# EAGLE design volume-control-rev-a (EAGLE 7.3.0)
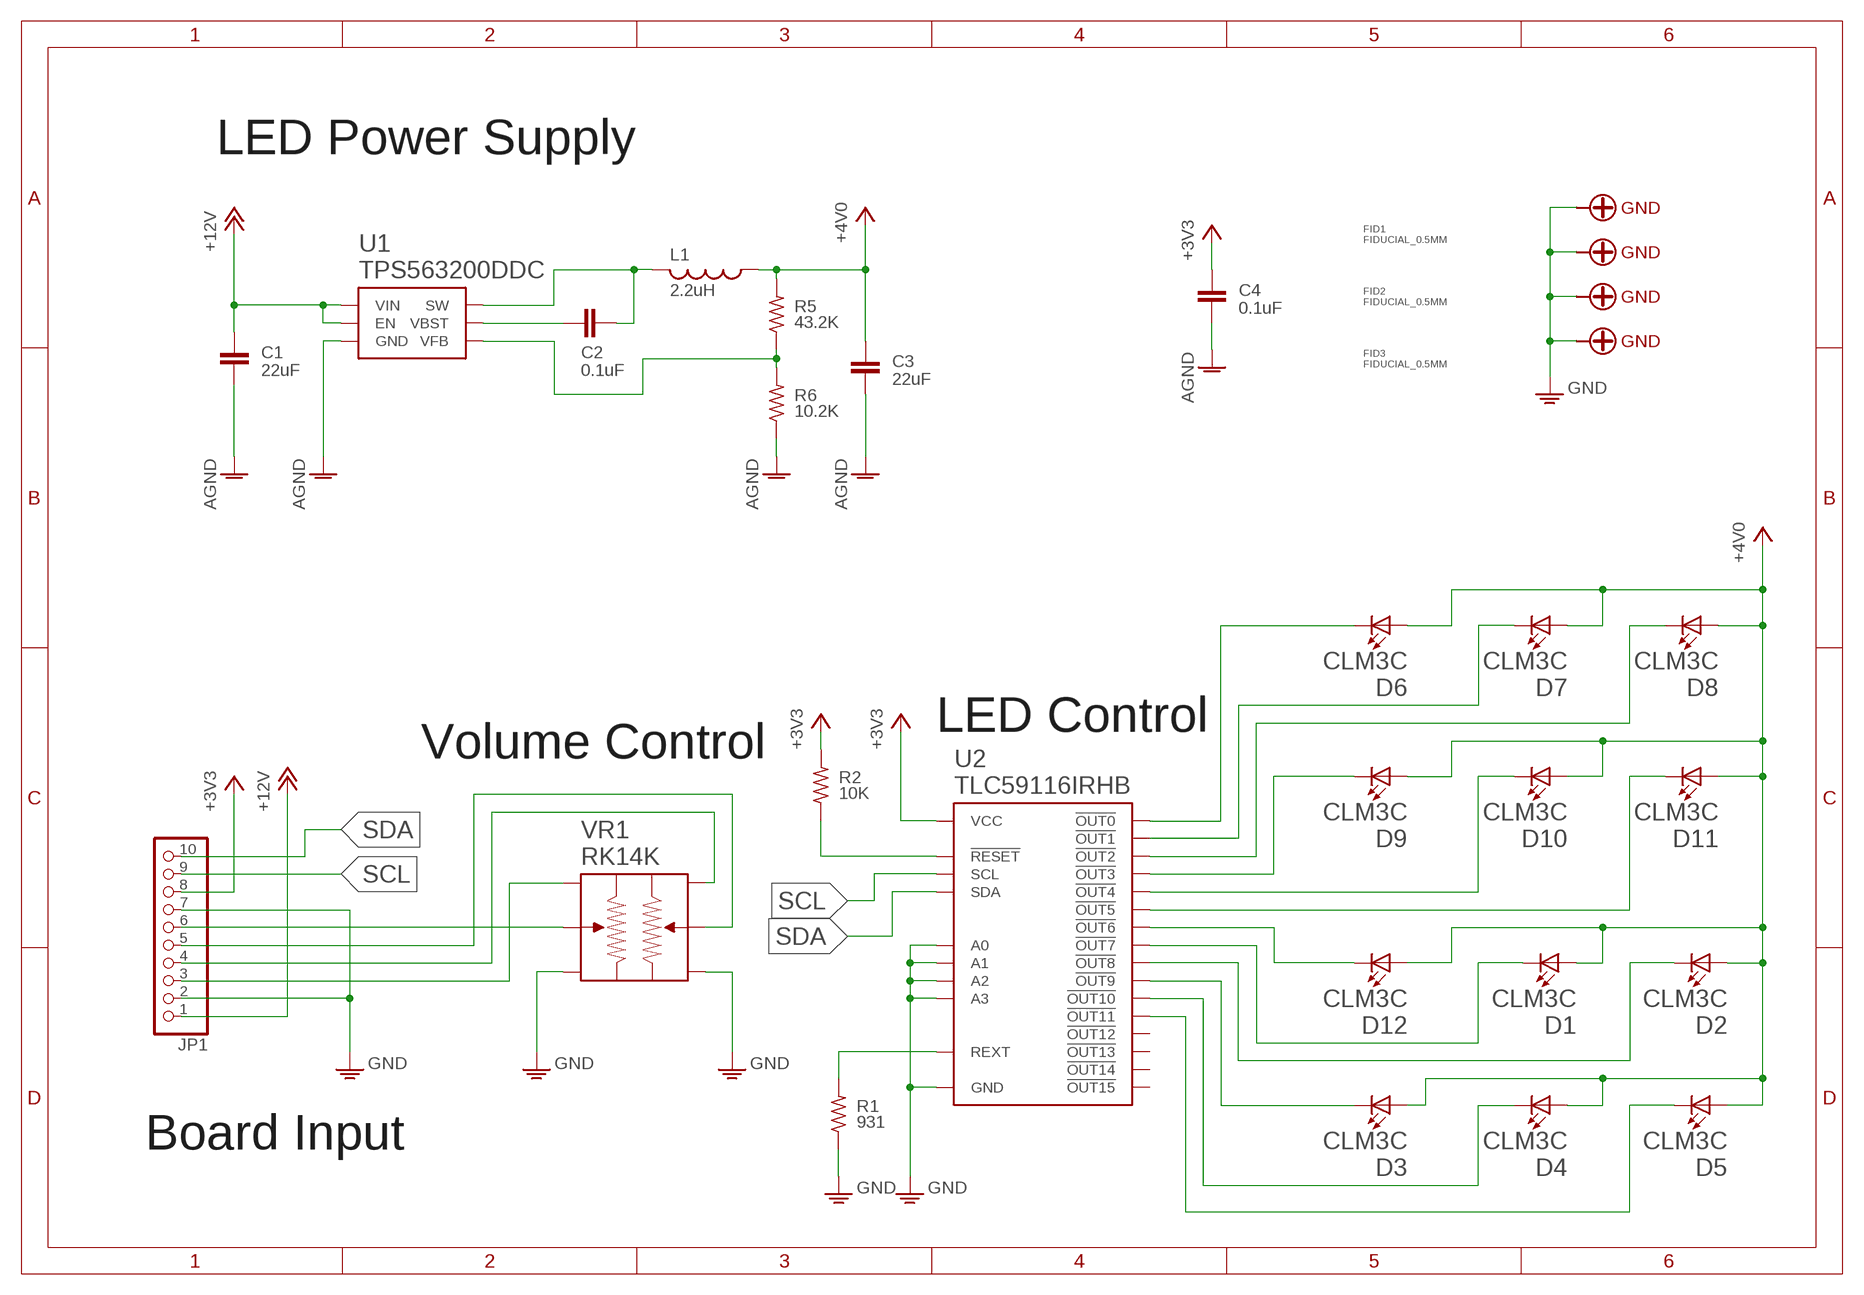
[diagram p0: schematic, sheet 1]

## Parts
AGND  SCREW-THRU-GND-#4  [SCREW-THRU-GND-#4]
C1  22uF  CAPACITOR-1210  [C1210]
C2  0.1uF  CAPACITOR-HORIZONTAL-0603  [C0603]
C3  22uF  CAPACITOR-1210  [C1210]
C4  0.1uF  CAPACITOR-0402  [C0402]
D1  CLM3C  [PLCC-2]
D2  CLM3C  [PLCC-2]
D3  CLM3C  [PLCC-2]
D4  CLM3C  [PLCC-2]
D5  CLM3C  [PLCC-2]
D6  CLM3C  [PLCC-2]
D7  CLM3C  [PLCC-2]
D8  CLM3C  [PLCC-2]
D9  CLM3C  [PLCC-2]
D10  CLM3C  [PLCC-2]
D11  CLM3C  [PLCC-2]
D12  CLM3C  [PLCC-2]
FID1  FIDUCIAL_0.5MM  [FIDUCIAL_0.5MM]
FID2  FIDUCIAL_0.5MM  [FIDUCIAL_0.5MM]
FID3  FIDUCIAL_0.5MM  [FIDUCIAL_0.5MM]
JP1  PINHD-1X10  [1X10]
L1  2.2uH  INDUCTOR-HORIZONTALXFL4020  [COILCRAFT-XFL4020]
R1  931  RESISTOR-0402  [R0402]
R2  10K  RESISTOR-0402  [R0402]
R5  43.2K  RESISTOR-0402  [R0402]
R6  10.2K  RESISTOR-0402  [R0402]
U1  TPS563200DDC  TPS562200DDC  [R-PDSO-G6-DBV]
U2  TLC59116IRHB  [S-PVQFN-N32-RHB]
U$2  SCREW-THRU-GND-#4  [SCREW-THRU-GND-#4]
U$3  SCREW-THRU-GND-#4  [SCREW-THRU-GND-#4]
U$4  SCREW-THRU-GND-#4  [SCREW-THRU-GND-#4]
VR1  RK14K  [RK14K]

## Nets
+3V3: C4.1 JP1.8 R2.2 U2.P$27(VCC)
+4V0: C3.1 D1.ANODE(A) D2.ANODE(A) D3.ANODE(A) D4.ANODE(A) D5.ANODE(A) D6.ANODE(A) D7.ANODE(A) D8.ANODE(A) D9.ANODE(A) D10.ANODE(A) D11.ANODE(A) D12.ANODE(A) L1.P$1 R5.2
+12V: C1.1 JP1.1 U1.3(VIN) U1.5(EN)
AGND: C1.2 C3.2 C4.2 R6.1 U1.1(GND)
GND: AGND.P$1(GND) AGND.P$2(GND) AGND.P$3(GND) AGND.P$4(GND) AGND.P$5(GND) AGND.P$6(GND) AGND.P$7(GND) AGND.P$8(GND) AGND.P$9(GND) JP1.2 JP1.7 R1.1 U2.P$1(A2) U2.P$2(A3) U2.P$7(GND) U2.P$18(GND) U2.P$23(GND) U2.P$31(A0) U2.P$32(A1) U2.P$EP1(GND) U2.P$EP2(GND) U2.P$EP3(GND) U2.P$EP4(GND) U2.P$EP5(GND) U2.P$EP(GND) U$2.P$1(GND) U$2.P$2(GND) U$2.P$3(GND) U$2.P$4(GND) U$2.P$5(GND) U$2.P$6(GND) U$2.P$7(GND) U$2.P$8(GND) U$2.P$9(GND) U$3.P$1(GND) U$3.P$2(GND) U$3.P$3(GND) U$3.P$4(GND) U$3.P$5(GND) U$3.P$6(GND) U$3.P$7(GND) U$3.P$8(GND) U$3.P$9(GND) U$4.P$1(GND) U$4.P$2(GND) U$4.P$3(GND) U$4.P$4(GND) U$4.P$5(GND) U$4.P$6(GND) U$4.P$7(GND) U$4.P$8(GND) U$4.P$9(GND) VR1.L3(OUT_L) VR1.R3(OUT_R)
LEFT_IN [audio]: JP1.3 VR1.L1(IN_L)
LEFT_OUT [audio]: JP1.6 VR1.L2(WIPER_L)
N$5: D6.CATHODE(C) U2.P$3(!OUT0)
N$6: D7.CATHODE(C) U2.P$4(!OUT1)
N$7: D8.CATHODE(C) U2.P$5(!OUT2)
N$8: D3.CATHODE(C) U2.P$15(!OUT9)
N$9: D4.CATHODE(C) U2.P$16(!OUT10)
N$10: D5.CATHODE(C) U2.P$17(!OUT11)
N$11: D9.CATHODE(C) U2.P$6(!OUT3)
N$12: D10.CATHODE(C) U2.P$8(!OUT4)
N$13: D11.CATHODE(C) U2.P$9(!OUT5)
N$14: D12.CATHODE(C) U2.P$10(!OUT6)
N$15: D1.CATHODE(C) U2.P$11(!OUT7)
N$16: D2.CATHODE(C) U2.P$14(!OUT8)
N$17: C2.2 L1.P$2 U1.2(SW)
N$18: C2.1 U1.6(VBST)
N$19: R5.1 R6.2 U1.4(VFB)
N$20: R2.1 U2.P$24(!RESET)
N$23: R1.2 U2.P$30(REXT)
RIGHT_IN [audio]: JP1.4 VR1.R1(IN_R)
RIGHT_OUT [audio]: JP1.5 VR1.R2(WIPER_R)
SCL: JP1.9 U2.P$25(SCL)
SDA: JP1.10 U2.P$26(SDA)
Unconnected: U2.P$19(!OUT12) U2.P$20(!OUT13) U2.P$21(!OUT14) U2.P$22(!OUT15)

## Notes on the sheet
- LED Power Supply
- LED Control
- Volume Control
- Board Input

## Library data of the parts
AGND U$2-U$4 = screws:SCREW-THRU-GND
C1 C3 C4 = passives:CAPACITOR: Capacitor
C2 = passives:CAPACITOR-HORIZONTAL: Capacitor, horizontal
D1-D12 = cree:CLM3C: Cree® PLCC2 1-in-1 SMD LED CLM3C; MPN: CLM3C-WKW-CXAYA453
FID1-FID3 = MF_Aesthetics:FIDUCIAL: Library: MF_Aesthetics Description: Fiducial marking for PCB alignment inside PNP and other machines.; HOUSEPART: NO; POPULATE: 0
JP1 = pin-headers:PINHD-1X10: PIN HEADER; MPN: 22-05-3101
L1 = passives:INDUCTOR-HORIZONTAL: INDUCTOR, American symbol; MPN: XFL4020-222MEB
R1 R2 R5 R6 = passives:RESISTOR
U1 = texas-instruments:TPS562200: 4.5-V To 17-V Input, 2-A, Synchronous Step-Down Voltage Regulator; MPN: TPS563200DDCT
U2 = texas-instruments:TLC59116: 16-Channel FM+ I2C-Bus Constant-Current LED Sink Driver; MPN: TLC59116IRHB
VR1 = alps:RK14K: 14mm Size Insulated Shaft Snap-in Type RK14K Series

## Net classes
1 audio: clearance 0.305 mm

## Board
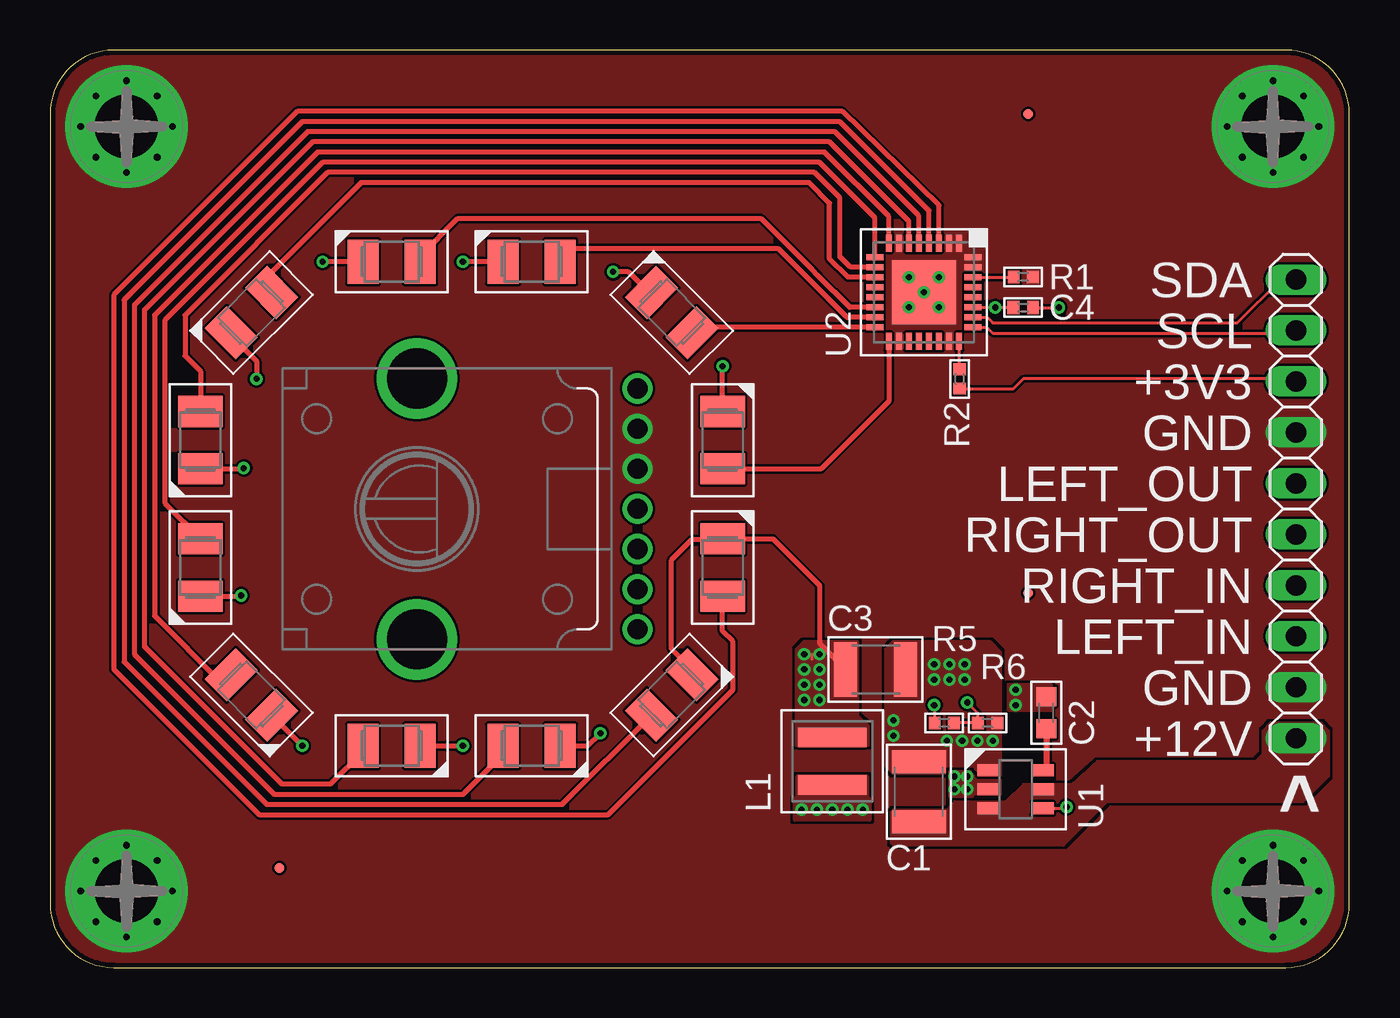
[diagram p1: board, top side]
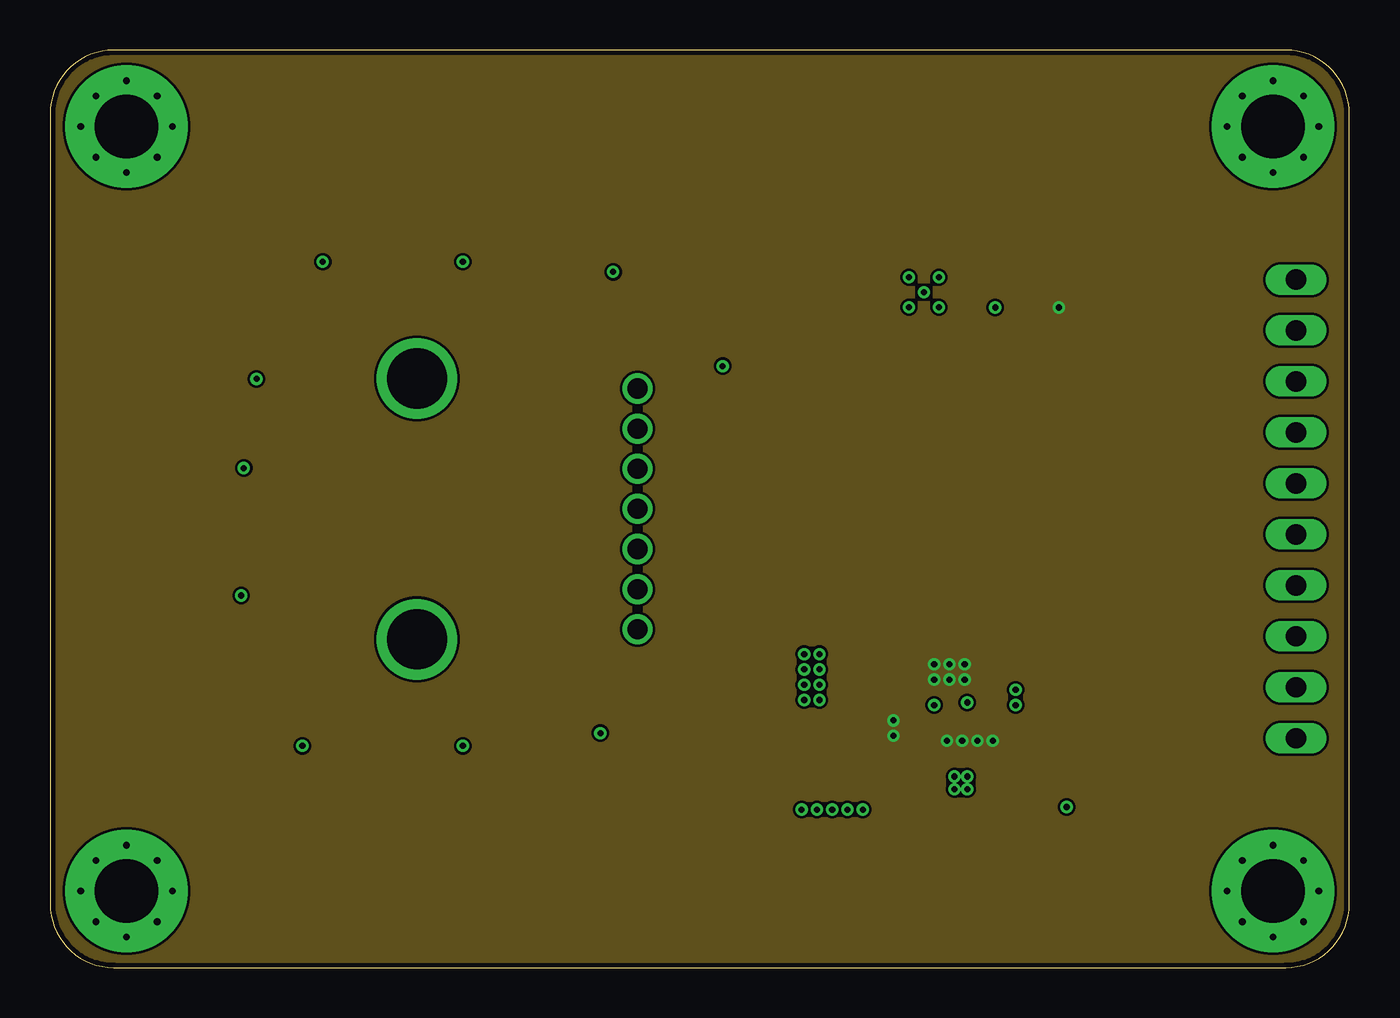
[diagram p2: board, inner layer Route2]
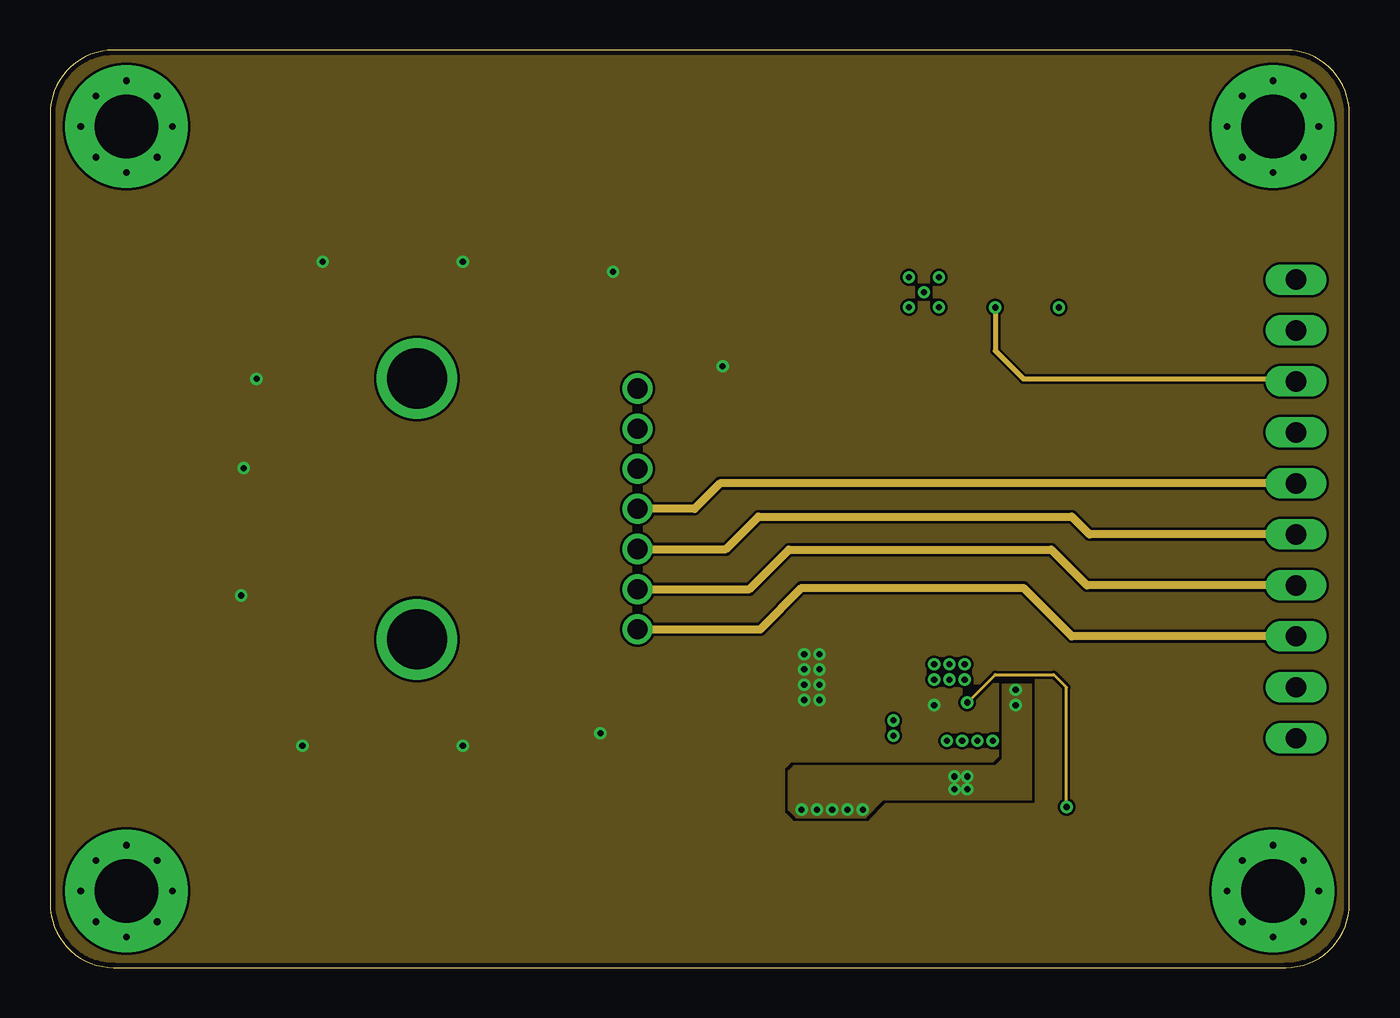
[diagram p3: board, inner layer Route15]
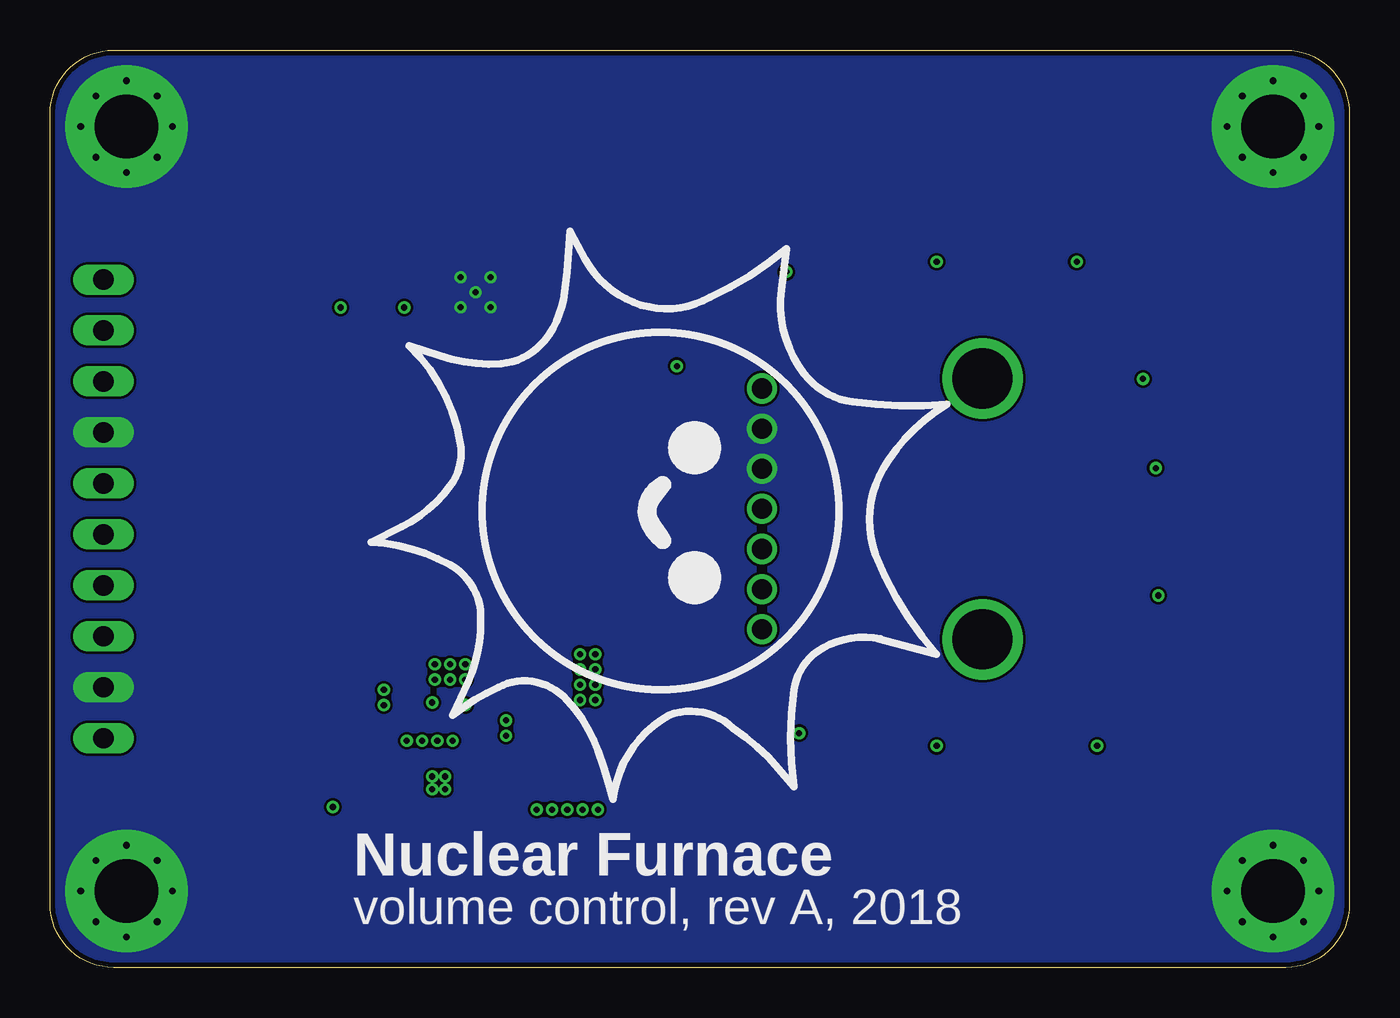
[diagram p4: board, bottom side, seen from below]

Size 64.77 x 45.72 mm. Coordinates in mm from the lower left corner, seen from the top.
Outline: 61.59,45.72 3.17,45.72 arc90 0,42.55 0,3.17 arc90 3.17,0 61.59,0 arc90 64.77,3.17 64.77,42.55 arc90 61.59,45.72
Copper layers (1+2*15+16): Top 0.035mm / dielectric 0.23mm / Route2 0.035mm / dielectric 0.93mm / Route15 0.035mm / dielectric 0.23mm / Bottom 0.035mm
Design rules "MF_Standard_4_Layer *": minimum track width 5mil, minimum drill 12mil, track to track 5mil, track to pad 5mil, pad to pad 5mil, via to via 5mil, smd to smd 0mil, copper to edge 10mil, drill to drill 10mil, minimum pad ring 6mil, minimum via ring 6mil, stop-mask expansion 2mil, vias tented up to drill 25mil, thermal gap 10mil

### Footprints (pad centres in the part's own frame; a part is rotated, then mirrored left to right if it is on the bottom)
SCREW-THRU-GND-#4 = drill 0.33: P$1 0,2.286; P$2 0,-2.286; P$3 -2.286,0; P$4 2.286,0; P$5 1.524,1.524; P$6 -1.524,1.524; P$7 -1.524,-1.524; P$8 1.524,-1.524 | drill 3.175 pad 6.096: P$9 0,0
C1210 = smd 1.15 x 2.7: 1 -1.5,0; 2 1.5,0
C0603 = smd 0.95 x 1: 1 -0.8,0; 2 0.8,0
C0402 = smd 0.58 x 0.66: 1 -0.49,0; 2 0.49,0
PLCC-2 = smd 1.55 x 2.2: ANODE -1.425,0; CATHODE 1.425,0
FIDUCIAL_0.5MM = smd 0.5 x 0.5: FID 0,0
1X10 = drill 1.016 long: 1 -11.43,0; 2 -8.89,0; 3 -6.35,0; 4 -3.81,0; 5 -1.27,0; 6 1.27,0; 7 3.81,0; 8 6.35,0; 9 8.89,0; 10 11.43,0
COILCRAFT-XFL4020 = smd 0.965 x 3.404: P$1 -1.181,0; P$2 1.181,0
R0402 = smd 0.59 x 0.64: 1 -0.48,0; 2 0.48,0
R-PDSO-G6-DBV = smd 0.6 x 1.1: 1 -0.95,-1.35; 2 0,-1.35; 3 0.95,-1.35; 4 0.95,1.35; 5 0,1.35; 6 -0.95,1.35
S-PVQFN-N32-RHB = smd 0.85 x 0.3: P$1 -2.45,1.75; P$2 -2.45,1.25; P$3 -2.45,0.75; P$4 -2.45,0.25; P$5 -2.45,-0.25; P$6 -2.45,-0.75; P$7 -2.45,-1.25; P$8 -2.45,-1.75; P$17 2.45,-1.75; P$18 2.45,-1.25; P$19 2.45,-0.75; P$20 2.45,-0.25; P$21 2.45,0.25; P$22 2.45,0.75; P$23 2.45,1.25; P$24 2.45,1.75 | smd 0.3 x 0.85: P$9 -1.75,-2.45; P$10 -1.25,-2.45; P$11 -0.75,-2.45; P$12 -0.25,-2.45; P$13 0.25,-2.45; P$14 0.75,-2.45; P$15 1.25,-2.45; P$16 1.75,-2.45; P$25 1.75,2.45; P$26 1.25,2.45; P$27 0.75,2.45; P$28 0.25,2.45; P$29 -0.25,2.45; P$30 -0.75,2.45; P$31 -1.25,2.45; P$32 -1.75,2.45 | smd 3.2 x 3.2: P$EP 0,0 | drill 0.305 pad 0.32: P$EP1 -0.75,0.75; P$EP2 0.75,0.75; P$EP4 -0.75,-0.75; P$EP5 0.75,-0.75 | drill 0.305 pad 0.356: P$EP3 0,0
RK14K = drill 1: DUMMY 6,-11; L1 -6,-11; L2 0,-11; L3 4,-11; R1 -4,-11; R2 -2,-11; R3 2,-11 | drill 3: MECH1 -6.5,0; MECH2 6.5,0

### Placement (x,y rotation side)
AGND  3.81,3.81 0 top
C1  43.31,8.76 90 top
C2  49.66,12.7 90 top
C3  41.15,14.86 0 top
C4  48.51,32.89 0 top
D1  10.03,32.64 45 top
D2  17.02,35.18 0 top
D3  24,35.18 0 top
D4  30.99,32.64 315 top
D5  33.53,26.29 270 top
D6  33.53,19.94 270 top
D7  30.99,13.59 225 top
D8  24,11.05 180 top
D9  17.02,11.05 180 top
D10  10.03,13.59 135 top
D11  7.49,19.94 90 top
D12  7.49,26.29 90 top
FID1  11.43,4.95 0 top
FID2  48.77,42.55 0 top
FID3  48.77,18.67 0 top
JP1  62.1,22.86 90 top
L1  38.99,10.29 270 top
R1  48.51,34.42 180 top
R2  45.34,29.34 270 top
R5  44.58,12.19 180 top
R6  46.74,12.19 180 top
U1  48.13,8.89 270 top
U2  43.56,33.66 270 top
U$1  [NF_LOGO]  49.66,37.85 270 bottom
U$2  3.81,41.91 0 top
U$3  60.96,3.81 0 top
U$4  60.96,41.91 0 top
VR1  18.29,22.86 90 top

### Tracks (layer width: path | path; a pad name or v marks a point on that pad's centre or on a via)
+3V3  (via drill 0.3 pad 0.3)
  Top 0.152: U2.P$27 47.1,32.91 | 47.1,32.91 v47.12,32.89 | JP1.8 61.98,29.34 48.51,29.34 48.01,28.83 45.37,28.83 R2.2 | 47.1,32.91 48.01,32.91 C4.1
  Route15 0.254: v47.12,32.89 47.12,30.73 48.51,29.34 61.98,29.34 JP1.8
+4V0  (via drill 0.3)
  Top 0.127: 37.97,15.37 37.97,15.62
  Top 0.152: R5.2 44.1,13.05 v44.07,13.08
  Top 0.254: D6.ANODE 34.54,21.36 | 34.54,21.36 36.04,21.36 38.35,19.05 38.35,16.15 C3.1 | D7.ANODE 32,14.87 30.99,15.88 30.99,20.32 32,21.34 34.52,21.34 34.54,21.36 | D5.ANODE v33.53,29.97 | D4.ANODE 29.85,33.65 28.83,34.67 v28.07,34.67 | D3.ANODE v20.57,35.18 | D2.ANODE v13.59,35.18 | D1.ANODE 9.03,31.49 10.29,30.23 v10.29,29.34 | D12.ANODE 9.62,24.86 v9.65,24.89 | D11.ANODE 9.5,18.51 v9.53,18.54 | D10.ANODE | D10.ANODE v12.57,11.05 | D9.ANODE v20.57,11.05 | D8.ANODE 26.8,11.05 v27.43,11.68
  other vias: 37.59,13.34 38.35,13.34 38.35,14.1 37.59,14.1 37.59,14.86 37.59,15.62 38.35,15.62 38.35,14.86
  pour Top (no thermals): 40.77,11.05 37.21,11.05 37.21,15.88 37.59,16.26 40.26,16.26 40.26,12.57 40.77,12.06
  pour Route15 (rank 2): 61.59,45.72 3.17,45.72 arc90 0,42.55 0,3.17 arc90 3.17,0 61.59,0 arc90 64.77,3.17 64.77,42.55 arc90
+12V
  Top 0.127: 49.61,8.76 U1.5
  pour Top (no thermals): 44.7,7.87 42.04,7.87 41.91,7.75 41.91,6.22 42.04,6.1 50.55,6.1 52.7,8.26 62.48,8.26 63.75,9.53 63.75,11.81 63.37,12.19 60.83,12.19 60.45,11.81 60.45,10.67 60.07,10.29 52.2,10.29 50.93,9.14 48.51,9.14 47.62,8.26 45.09,8.26
AGND  (via drill 0.3 pad 0.3)
  Top 0.152: C4.2 v50.29,32.89
  other vias: 44.07,15.11 45.47,11.3 46.23,11.3 46.99,11.3 44.07,14.35 42.04,11.56 42.04,12.32 44.83,14.35 44.83,15.11 45.59,15.11 44.7,11.3 45.59,14.35
  pour Top (rank 2, no thermals): 47.37,9.53 46.35,9.53 45.97,9.91 44.83,9.91 44.58,9.65 42.04,9.65 41.66,10.03 41.66,15.88 42.04,16.26 46.86,16.26 47.37,15.75
  pour Route2 (no thermals): 61.59,0 3.17,0 arc-90 0,3.17 0,42.55 arc-90 3.17,45.72 61.59,45.72 arc-90 64.77,42.55 64.77,3.17 arc-90
GND
  pour Top (rank 4, no thermals): 61.59,0 3.17,0 arc-90 0,3.17 0,42.55 arc-90 3.17,45.72 61.59,45.72 arc-90 64.77,42.55 64.77,3.17 arc-90
  pour Bottom (no thermals): 61.59,0 3.17,0 arc-90 0,3.17 0,42.55 arc-90 3.17,45.72 61.59,45.72 arc-90 64.77,42.55 64.77,3.17 arc-90
LEFT_IN
  Route15 0.406: VR1.L1 35.4,16.86 37.47,18.92 48.51,18.92 50.93,16.51 JP1.3
LEFT_OUT
  Route15 0.406: JP1.6 33.4,24.13 32.13,22.86 VR1.L2
N$5
  Top 0.254: U2.P$3 44.31,37.98 39.5,42.67 12.32,42.67 3.17,33.53 3.17,14.86 10.41,7.62 27.81,7.62 34.04,13.84 34.04,16.26 33.53,16.76 D6.CATHODE
N$6
  Top 0.254: U2.P$4 43.81,37.72 39.37,42.16 12.57,42.16 3.68,33.27 3.68,15.24 10.79,8.13 25.53,8.13 D7.CATHODE
N$7
  Top 0.254: U2.P$5 43.31,37.46 39.12,41.66 12.83,41.66 4.19,33.02 4.19,15.62 11.18,8.64 20.57,8.64 22.35,10.41 22.35,10.82 D8.CATHODE
N$8
  Top 0.254: U2.P$15 39.73,32.41 36.32,35.81 26.06,35.81 D3.CATHODE
N$9
  Top 0.254: U2.P$16 32.27,31.91 D4.CATHODE
N$10
  Top 0.254: U2.P$17 41.81,28.22 38.45,24.86 D5.CATHODE
N$11
  Top 0.254: U2.P$6 42.81,37.2 38.86,41.15 13.08,41.15 4.7,32.77 4.7,16 11.56,9.14 13.97,9.14 15.59,10.77 D9.CATHODE
N$12
  Top 0.254: U2.P$8 41.81,37.44 38.61,40.64 13.34,40.64 5.21,32.51 5.21,17.53 8.51,14.22 8.65,14.22 D10.CATHODE
N$13
  Top 0.254: U2.P$9 41.11,37.38 38.35,40.13 13.59,40.13 5.71,32.26 5.71,23.14 D11.CATHODE
N$14
  Top 0.254: U2.P$10 39.9,34.91 39.37,35.43 39.37,38.35 38.1,39.62 13.84,39.62 6.73,32.51 6.73,30.48 7.49,29.72 D12.CATHODE
N$15
  Top 0.254: U2.P$11 39.76,34.41 38.86,35.31 38.86,38.1 37.85,39.12 15.49,39.12 11.04,34.66 D1.CATHODE
N$16
  Top 0.254: U2.P$14 39.87,32.91 38.29,34.48 37.97,34.8 35.43,37.34 20.32,37.34 18.44,35.46 D2.CATHODE
N$17  (via drill 0.3, 0.3 pad 0.3)
  other vias: 45.09,9.53 45.72,9.53 45.09,8.89 45.72,8.89 37.47,7.87 38.23,7.87 38.99,7.87 39.75,7.87 40.51,7.87 48.13,13.84 48.13,13.08
  pour Top (no thermals): 47.37,8.64 46.1,8.64 45.97,8.51 44.83,8.51 44.83,9.78 45.85,9.78 46.23,9.4 47.37,9.4
  pour Route15: 48.9,14.1 48.9,8.38 41.53,8.38 40.64,7.49 37.21,7.49 36.83,7.87 36.83,9.78 37.08,10.03 47.12,10.03 47.5,10.41 47.5,14.1
  pour Top (no thermals): 40.77,9.53 37.21,9.53 37.21,8.51 37.08,8.38 37.08,7.37 40.89,7.37 40.89,8.38 40.77,8.51
  pour Top (no thermals): 49.91,14.1 47.75,14.1 47.75,12.83 49.91,12.83
N$18
  Top 0.305: C2.1 49.66,10.01 U1.6
N$19  (via drill 0.3 pad 0.3)
  Top 0.152: U1.4 50.61,7.94 v50.67,8 | 46.23,12.22 R6.2 | R6.2 R5.1 | v45.72,13.21 46.26,12.67 R6.2
  Route15 0.152: v50.67,8 50.67,13.97 50.04,14.61 47.12,14.61 v45.72,13.21
N$20
  Top 0.152: U2.P$24 45.31,29.84 R2.1
N$23
  Top 0.152: U2.P$30 48.02,34.41 R1.2
RIGHT_IN
  Route15 0.406: VR1.R1 34.86,18.86 36.83,20.83 49.91,20.83 51.69,19.05 JP1.4
RIGHT_OUT
  Route15 0.406: VR1.R2 33.69,20.86 35.31,22.48 50.93,22.48 51.82,21.59 JP1.5
SCL
  Top 0.152: U2.P$25 46.71,31.91 46.99,31.62 61.98,31.62 JP1.9
SDA
  Top 0.152: U2.P$26 46.72,32.41 46.99,32.13 59.18,32.13 61.34,34.29 JP1.10

### Text on the board
bPlace: volume control, rev A, 2018
tNames: SDA | SCL | +3V3 | GND | LEFT_OUT | RIGHT_OUT | RIGHT_IN | LEFT_IN | GND | +12V | >